# Altium project hethongnhung.PrjPcb
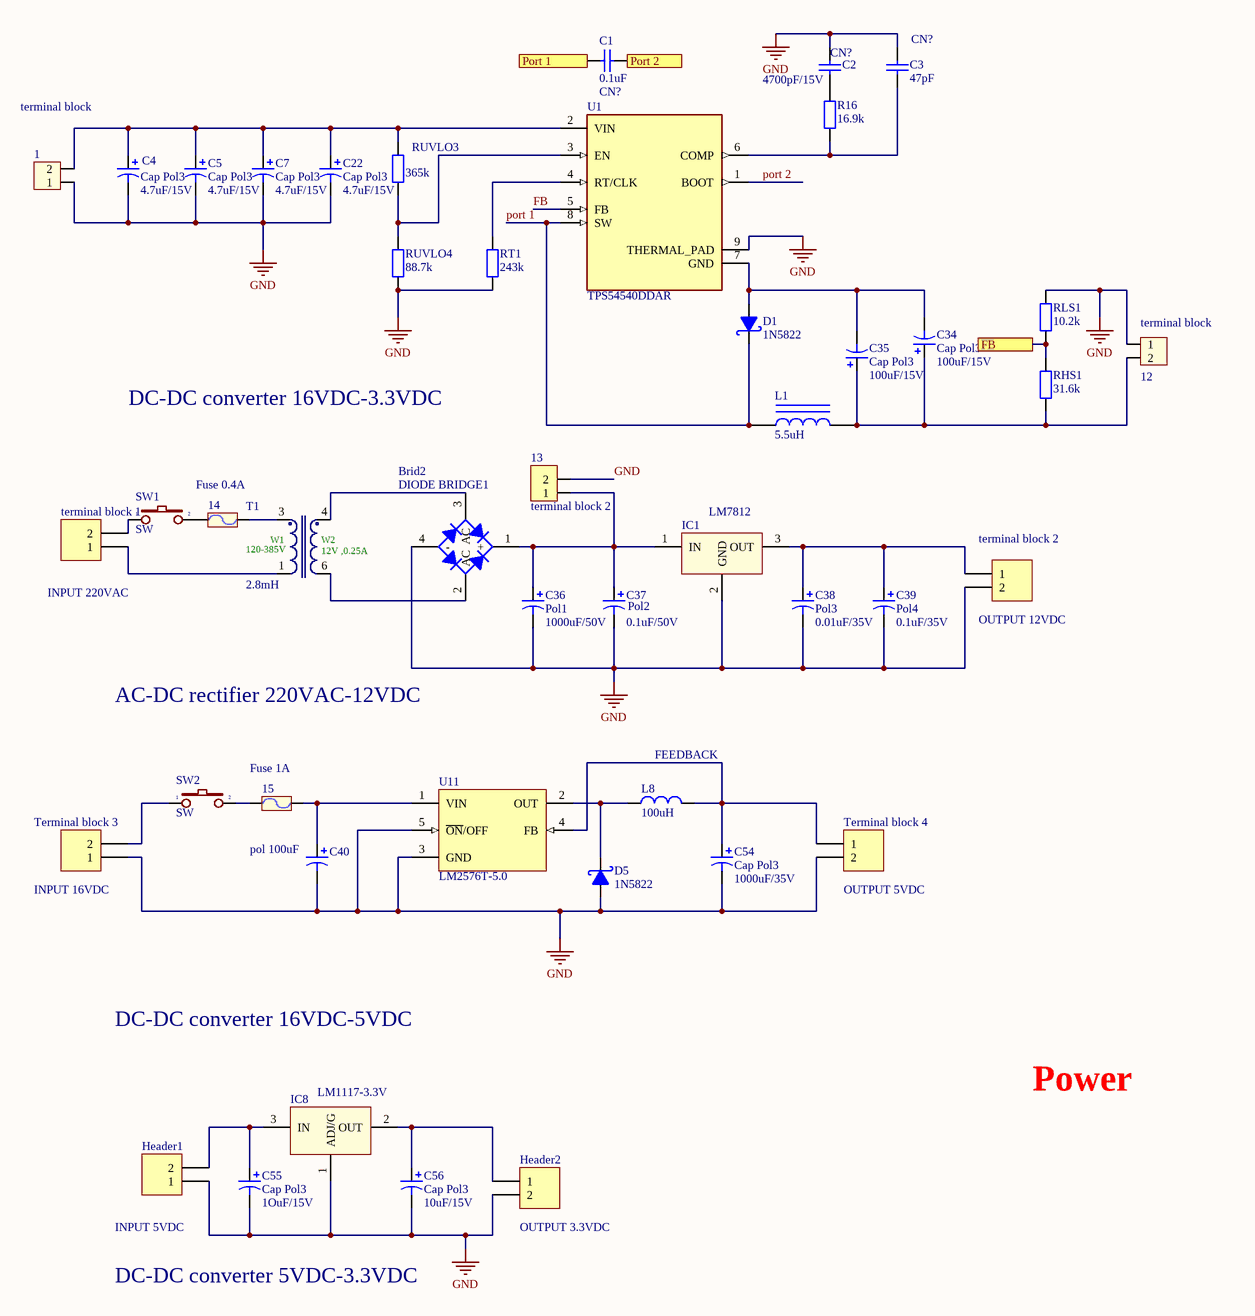
[diagram p0: nguon.SchDoc]
9 sheets, 223 parts. Net scope: flat (ports and power ports of the same name join across sheets).
Sheets:
  nguon.SchDoc
  temperature.SchDoc
  humidity.SchDoc
  lcdi2c.SchDoc
  nhung.SchDoc
  controltemperature.SchDoc
  humiditycontrol.SchDoc
  Alarm.SchDoc
  MCU.SchDoc

## Sheet nguon.SchDoc
size A3

### Parts
(Parts that share a designator on the sheet are numbered #1, #2 ... from top to bottom, then left to right.)
1  terminal block  [HED2]
12  terminal block  [HED2]
13  terminal block 2  [HDR2]
14  Fuse 0.4A  [Fuse]
15  Fuse 1A  [Fuse]
Brid2  DIODE BRIDGE1  [CAU 5A]
C1  0.1uF  value CN?  [CNP]
C2  4700pF/15V  value CN?  [CNP]
C3  47pF  value CN?  [CNP]
C4  Cap Pol3  value 4.7uF/15V  [CP2/5]
C5  Cap Pol3  value 4.7uF/15V  [CP2/5]
C7  Cap Pol3  value 4.7uF/15V  [CP2/5]
C22  Cap Pol3  value 4.7uF/15V  [CP2/5]
C34  Cap Pol3  value 100uF/15V  [CP2/5]
C35  Cap Pol3  value 100uF/15V  [CP2/5]
C36  Pol1  value 1000uF/50V  [CP2/5]
C37  Pol2  value 0.1uF/50V  [CP2/5]
C38  Pol3  value 0.01uF/35V  [CP2/5]
C39  Pol4  value 0.1uF/35V  [CP2/5]
C40  pol 100uF  [C10mm]
C54  Cap Pol3  value 1000uF/35V  [CP2/5]
C55  Cap Pol3  value 1OuF/15V  [CP2/5]
C56  Cap Pol3  value 10uF/15V  [CP2/5]
D1  1N5822  [D5A]
D5  1N5822  [D5A]
Header1  Header 2  [HEDH]  (value not drawn)
Header2  Header 2  [HEDH]  (value not drawn)
IC1  LM7812  [QTO-220]
IC8  LM1117-3.3V  [SOT223-4N]
L1#1  value 5.5uH  [R1/2W]  (hidden comment: Inductor Iron)
L8  100uH  [L/0.4]
R16  16.9k  [R1/4W]
RHS1  31.6k  [R1/4W]
RLS1  10.2k  [R1/4W]
RT1  243k  [R1/4W]
RUVLO3  365k  [R1/4W]
RUVLO4  88.7k  [R1/4W]
SW1  SW  [SW2]
SW2  SW  [SW2]
T1  2.8mH  [EE13/7/4-Vertical/(EF12.6)]
terminal_block_1  Header 2  [HEDH]  (value not drawn)
terminal_block_2  Header 2  [HEDH]  (value not drawn)
Terminal_block_3  Header 2  [HEDH]  (value not drawn)
Terminal_block_4  Header 2  [HEDH]  (value not drawn)
U1  TPS54540DDAR  [CONV_TPS54540DDAR]
U11  LM2576T-5.0  [LM2576t]

### Ports
FB, Port 1, Port 2

### Nets
GND: 1.1 12.1 13.2 Brid2.4(-) C2.2 C3.2 C4.2 C5.2 C7.2 C22.2 C36.2 C37.2 C38.2 C39.2 C40.2 C54.2 C55.2 C56.2 D5.1(A) Header1.1 Header2.2 IC1.2(GND) IC8.1(ADJ/G) RLS1.2 RT1.1 RUVLO4.1 terminal_block_2.2 Terminal_block_3.1 Terminal_block_4.2 U1.9(THERMAL_PAD) U11.3(GND) U11.5(~{ON}/OFF)
FB: U1.5(FB)
port 1: D1.2(K) L1#1.1 U1.8(SW)
port 2: U1.1(BOOT)
Net1_2: 1.2 C4.1 C5.1 C7.1 C22.1 RUVLO3.2 U1.2(VIN)
Net12_2: 12.2 C34.1 C35.1 L1#1.2 RHS1.1
Net13_1: 13.1 Brid2.1(+) C36.1 C37.1 IC1.1(IN)
Net14_1: 14.1 SW1.2
Net14_2: 14.2 T1.3
Net15_1: 15.1 SW2.2
Net15_2: 15.2 C40.1 U11.1(VIN)
NetBrid2_2: Brid2.2(AC) T1.6
NetBrid2_3: Brid2.3(AC) T1.4
NetC1_1: C1.1 ; port Port 2
NetC1_2: C1.2 ; port Port 1
NetC2_1: C2.1 R16.2
NetC3_1: C3.1 R16.1 U1.6(COMP)
NetC34_2: C34.2 C35.2 D1.1(A) U1.7(GND)
NetC38_1: C38.1 C39.1 IC1.3(OUT) terminal_block_2.1
NetC54_1: C54.1 L8.2 Terminal_block_4.1 U11.4(FB)
NetC55_1: C55.1 Header1.2 IC8.3(IN)
NetC56_1: C56.1 Header2.1 IC8.2(OUT)
NetD5_2: D5.2(K) L8.1 U11.2(OUT)
NetRHS_2: RHS1.2 RLS1.1 ; port FB
NetRT1_2: RT1.2 U1.4(RT/CLK)
NetRUVLO3_1: RUVLO3.1 RUVLO4.2 U1.3(EN)
NetSW1_1: SW1.1 terminal_block_1.2
NetSW2_1: SW2.1 Terminal_block_3.2
NetT1_1: T1.1 terminal_block_1.1

### Notes on the sheet
- DC-DC converter 16VDC-3.3VDC
- (near terminal_block_1) INPUT 220VAC
- (near terminal_block_2) OUTPUT 12VDC
- AC-DC rectifier 220VAC-12VDC
- (near L8) FEEDBACK
- (near Terminal_block_3) INPUT 16VDC
- (near Terminal_block_4) OUTPUT 5VDC
- DC-DC converter 16VDC-5VDC
- Power
- (near Header1) INPUT 5VDC
- DC-DC converter 5VDC-3.3VDC
- (near Header2) OUTPUT 3.3VDC
- Title
- Size:
- Date:
- A3
- Number:
- Time:
- Revision:
- Sheet
- of
- File:
- (in symbol Tranf7) W1; W2; 120-385V; 12V ,0.25A

### Library data of the parts
1 12 = Hed2: Header 2 (Green); Value: Header 2
13 = Header2: Header IDC, 2 x 1 Pin Vertical 2.54mm Pitch (Non-Boxed, Male); Manufacturer: W¨¹rth Elektronik eiSos GmbH; partNo: 613002143121; ComponentLink1 Description: Manufacturer; ComponentLink2 Description: Datasheet; NoPins: 02; Created Date: 29 March 2013; ComponentLink1URL: http://www.we-online.com; ComponentLink2URL: http://katalog.we-online.de/em/datasheet/6130xx143121.pdf; Created by: Karrer Zheng
14 15 = Fuse: Designed by: VanDungEvn; Value: Fuse
C1-C3 = Cap Semi: Capacitor (Semiconductor SIM Model); Value: 104; LatestRevisionDate: 17-Jul-2002; LatestRevisionNote: Re-released for DXP Platform.; PackageReference: C1206; Publisher: Altium Limited
C4 C5 C7 C22 C34 C35 C54-C56 = Cap Pol3: Polarized Capacitor (Surface Mount); VALUE: C?; LatestRevisionDate: 17-Jul-2002; LatestRevisionNote: Re-released for DXP Platform.; PackageReference: C0805; Publisher: Altium Limited
C36-C39 = Cap Pol3_5: Polarized Capacitor (Surface Mount); VALUE: C?; LatestRevisionDate: 17-Jul-2002; LatestRevisionNote: Re-released for DXP Platform.; PackageReference: C0805; Publisher: Altium Limited
C40 = Cap Pol 12mm: Polarized Capacitor (Axial); Published: 8-Jun-2000; LatestRevisionDate: 17-Jul-2002; LatestRevisionNote: Re-released for DXP Platform.; PackageReference: POLAR0.8; Publisher: Altium Limited
D1 D5 = 1N5822: Schottky Rectifiers; Value: Diode c?m 1N5408
Header1 Header2 terminal_block_1 terminal_block_2 Terminal_block_3 Terminal_block_4 = Header 2: Header, 2-Pin; Manufacturer: Generic Components; Class: Connector; Value: Header 2
IC1 = LM78xx: On ap +, from + 5 to + 24VDC; Value: LM7805
IC8 = LM1117: Available in 1.8V, 2.5V, 2.85V, 3.3V, 5V, and  Adjustable Versions; Value: LM317
L1#1 = Inductor Iron_1: Magnetic-Core Inductor; Manufacturer: Generic Components; Class: Passive; Published: 1999; SubClass: Inductor
L8 = Inductor: Value: 150 mH
R16 RHS1 RLS1 RT1 RUVLO3 RUVLO4 = R1/4W: Resistor 1/4W; Value: R1/4W - 1K
SW1 SW2 = SW2: Switch button 2 pin; Value: SW chip 2 pin
T1 = Tranf7: Off-Line Transformer WE-UNIT , L=2.8mH; PartNo: 7491181012; Manufacturer: Würth Elektronik eiSos GmbH; Turns Ratio: 8.1:1; Input Voltage (AC): 85-265; Output Current (A): 0.5; Output Voltage (DC): 12; Inductance: 2.8mH; ComponentLink1Description: Manufacturer; ComponentLink1URL: http://www.we-online.de; Created by: Otto Christin; Created Date: OCT 2013; ComponentLink2Description: Datasheet; ComponentLink2URL: http://www.we-online.de/katalog/media/pdf/7491181012.pdf
U1 = TPS54540DDAR: 42 V, 5 A, Step-Down DC-DC Converter with Eco-Mode 8-SO PowerPAD -40 to 125; MF: Texas Instruments; SnapEDA_Link: https://www.snapeda.com/parts/TPS54540DDAR/Texas%20Instruments/view-part/454643/?ref=snap; Package: HSOIC-8 Texas Instruments; Check_prices: https://www.snapeda.com/parts/TPS54540DDAR/Texas%20Instruments/view-part/454643/?ref=eda; MP: TPS54540DDAR; Value: *; Digi-Key_Part_Number: 296-39422-1-ND; Purchase-URL: https://pricing.snapeda.com/search/part/TPS54540DDAR/?ref=eda
U11 = LM2576T-5.0: SIMPLE SWITCHER; 3A Step-Down Voltage Regulator; Manufacturer: National Semiconductor; PackageTopMarking: NSUZXYTT*LM2576T*-5.0 P+; PowerWise: N; FirstPublished: 4-Dec-2008; DatasheetVersion: Aug-2004; PackageVersion: revJ, Jan-1992; PackageReference: T05A; Publisher: Altium Limited; PackageDescription: TO-220, Molded, 5 Lead, Straight; CompType: Switcher; PartNumber: LM2576T-5.0; RoHS: O; PinCount: 5; DigiKeyPartNumber: LM2576T-5.0-ND; Code_JEDEC: TO-220-AB; ComponentLink1Description: LM2576 Datasheet; ComponentLink1URL: http://www.national.com/ds/LM/LM2576.pdf; ComponentLink2Description: LM2576 Web Page; ComponentLink2URL: http://www.national.com/pf/LM/LM2576.html; ComponentLink3Description: T05A Package Page; ComponentLink3URL: http://www.national.com/packaging/folders/t05a.html

## Sheet temperature.SchDoc
size A
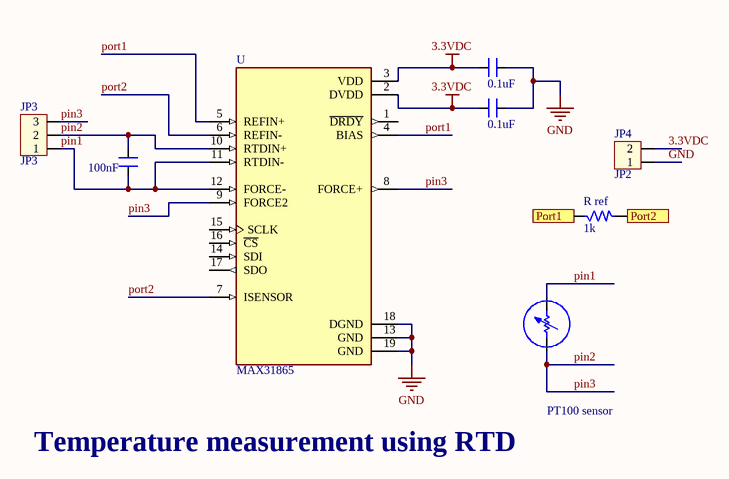
[diagram p1: temperature.SchDoc]

### Parts
(Parts that share a designator on the sheet are numbered #1, #2 ... from top to bottom, then left to right.)
?#1  0.1uF  [SM-0805]
?#2  0.1uF  [SM-0805]
?#3  100nF  [SM-0805]
?#4  (no value)  [AXIAL-0.7]
JP3  JP3  [CON3]
JP4  JP2  [CON2]
R_ref  1k  [SM-RES-1206]
U  MAX31865  [SOP65P777X199-20N]

### Ports
Port1, Port2

### Nets
3.3VDC: ?#1.1 ?#2.1 JP4.2 U.2(DVDD) U.3(VDD)
GND: ?#1.2 ?#2.2 JP4.1 U.13(GND) U.18(DGND) U.19(GND)
pin1: ?#3.1 ?#4.2 JP3.1 U.11(RTDIN-) U.12(FORCE-)
pin2: ?#3.2 ?#4.1 JP3.2 JP3.3 U.8(FORCE+) U.9(FORCE2) U.10(RTDIN+)  [also labelled pin3]
port1: U.4(BIAS) U.5(REFIN+)
port2: U.6(REFIN-) U.7(ISENSOR)
NetR_ref_1: R_ref.1 ; port Port1
NetR_ref_2: R_ref.2 ; port Port2

Not connected (* = marked no-connect by the designer): U 1(~{DRDY}) 14(SDI) 15(SCLK) 16(~{CS}) 17(SDO)

### Notes on the sheet
- PT100 sensor
- Temperature measurement using RTD

### Library data of the parts
?#1-?#3 = CM: Cap SMD; Value: 103
?#4 = Res Adj1: Variable Resistor; Set Position: 0.5; Published: 8-Jun-2000; LatestRevisionDate: 17-Jul-2002; LatestRevisionNote: Re-released for DXP Platform.; PackageReference: AXIAL-0.7; Publisher: Altium Limited; PackageDescription: Axial Device, Thru-Hole; 2 Leads; 0.7 in Pin Spacing
JP3 = Con3: Connector 3; Value: Connector 3
JP4 = Con2: Connector 2; Value: Connector 2
R_ref = R: Resistor 1/4W; Value: R1/4W - 1K
U = MAX31865AAP+: Temp Monitoring System _Sensor_ External Sensor SPI Output 20-SSOP; MF: Maxim Integrated; Price: None; Value: *; MP: MAX31865AAP+; Package: SSOP-20 Maxim; SnapEDA_Link: https://www.snapeda.com/parts/MAX31865AAP%2B/Maxim%20Integrated/view-part/215216/?ref=snap; Availability: Unavailable

## Sheet humidity.SchDoc
size A
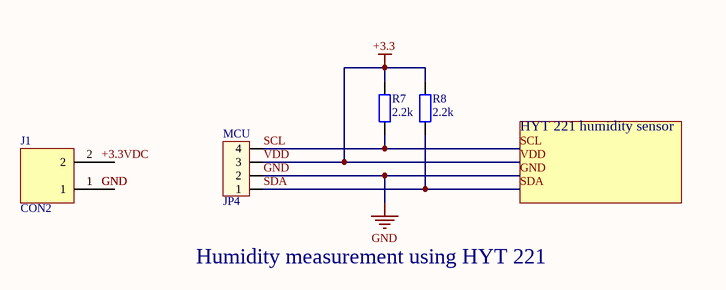
[diagram p2: humidity.SchDoc]

### Parts
J1  CON2  [HEDH]
MCU  JP4  [CON4]
R7  2.2k  [R1/4W]
R8  2.2k  [R1/4W]

### Nets
GND: MCU.2
VDD: MCU.3 R7.2 R8.2  [also labelled +3.3]
SCL: MCU.4 R7.1
SDA: MCU.1 R8.1

Not connected (* = marked no-connect by the designer): J1 1 2

### Notes on the sheet
- HYT 221 humidity sensor
- Humidity measurement using HYT 221
- Labels drawn without touching a wire or pin: +3.3VDC

### Library data of the parts
J1 = CON2_1
MCU = Con4: Connector 4; Value: Connector 4
R7 R8 = R1/4W: Resistor 1/4W; Value: R1/4W - 1K

## Sheet lcdi2c.SchDoc
size A
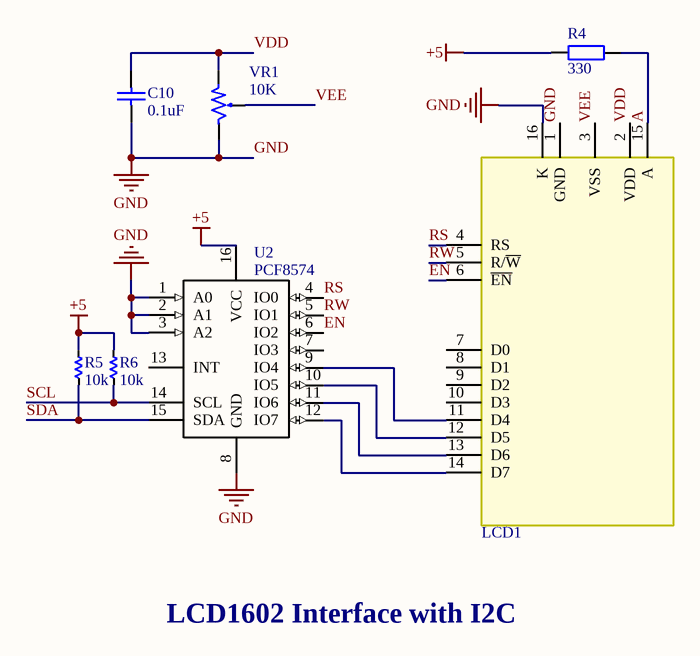
[diagram p3: lcdi2c.SchDoc]

### Parts
C10  0.1uF  [CNP]
LCD1  LCD16x2A  [LCD16X2]  (value not drawn)
R4  330  [R1/4W]
R5  10k  [RES-SMD-0805]
R6  10k  [RES-SMD-0805]
U2  PCF8574  [SO16L]
VR1  10K  [VR]

### Nets
+5: R4.1 R5.1 R6.1 U2.16(VCC)
GND: C10.1 LCD1.1(GND) LCD1.16(K) U2.1(A0) U2.2(A1) U2.3(A2) U2.8(GND) VR1.3
A: LCD1.15(A) R4.2
EN: LCD1.6(~{EN}) U2.6(IO2)
RS: LCD1.4(RS) U2.4(IO0)
RW: LCD1.5(R/~{W}) U2.5(IO1)
SCL: R6.2 U2.14(SCL)
SDA: R5.2 U2.15(SDA)
VDD: C10.2 LCD1.2(VDD) VR1.1
VEE: LCD1.3(VSS) VR1.2
NetLCD1_11: LCD1.11(D4) U2.9(IO4)
NetLCD1_12: LCD1.12(D5) U2.10(IO5)
NetLCD1_13: LCD1.13(D6) U2.11(IO6)
NetLCD1_14: LCD1.14(D7) U2.12(IO7)

Not connected (* = marked no-connect by the designer): LCD1 7(D0) 8(D1) 9(D2) 10(D3); U2 7(IO3) 13(INT)

### Notes on the sheet
- LCD1602 Interface with I2C

### Library data of the parts
C10 = Cap Semi: as C1 on sheet nguon; LatestRevisionDate: 17-Jul-2002; LatestRevisionNote: Re-released for DXP Platform.; PackageReference: C1206; Publisher: Altium Limited
LCD1 = LCD16x2: LCD dipslay 16 char, 2 line; Value: LCD16x2A
R4 = R1/4W: Resistor 1/4W; Value: R1/4W - 1K
R5 R6 = Res-SMD: Resistor; Manufacturer: Generic Components; Class: Passive; Published: 08/06/2000; Publisher: Altium Hobart Technology Centre
U2 = PCF8574: I2C PORT EXPANDER; Manufacturer Part Number: PCF8574T/3,512; Manufacturer: NXP Semiconductors; Includes: POR; Interface: I²C; Interrupt Output: Yes; Number of I /O: 8; Voltage - Supply: 2.5 V ~ 6 V; Frequency - Clock: 100KHz; Supplier 1: Digi-Key; Supplier Part Number 1: 568-1076-5-ND; Package / Case: 16-SOIC (7.5mm Width); Category: Integrated Circuits (ICs); Supplier Part Number: 568-1076-5-ND; Operating Temperature: -40°C ~ 85°C; Packaging: Tube; RoHS: RoHS Compliant; Supplier: Digi-Key
VR1 = VR1: Var Resistor; Value: VR 10K

## Sheet nhung.SchDoc
size 457 x 355 mm
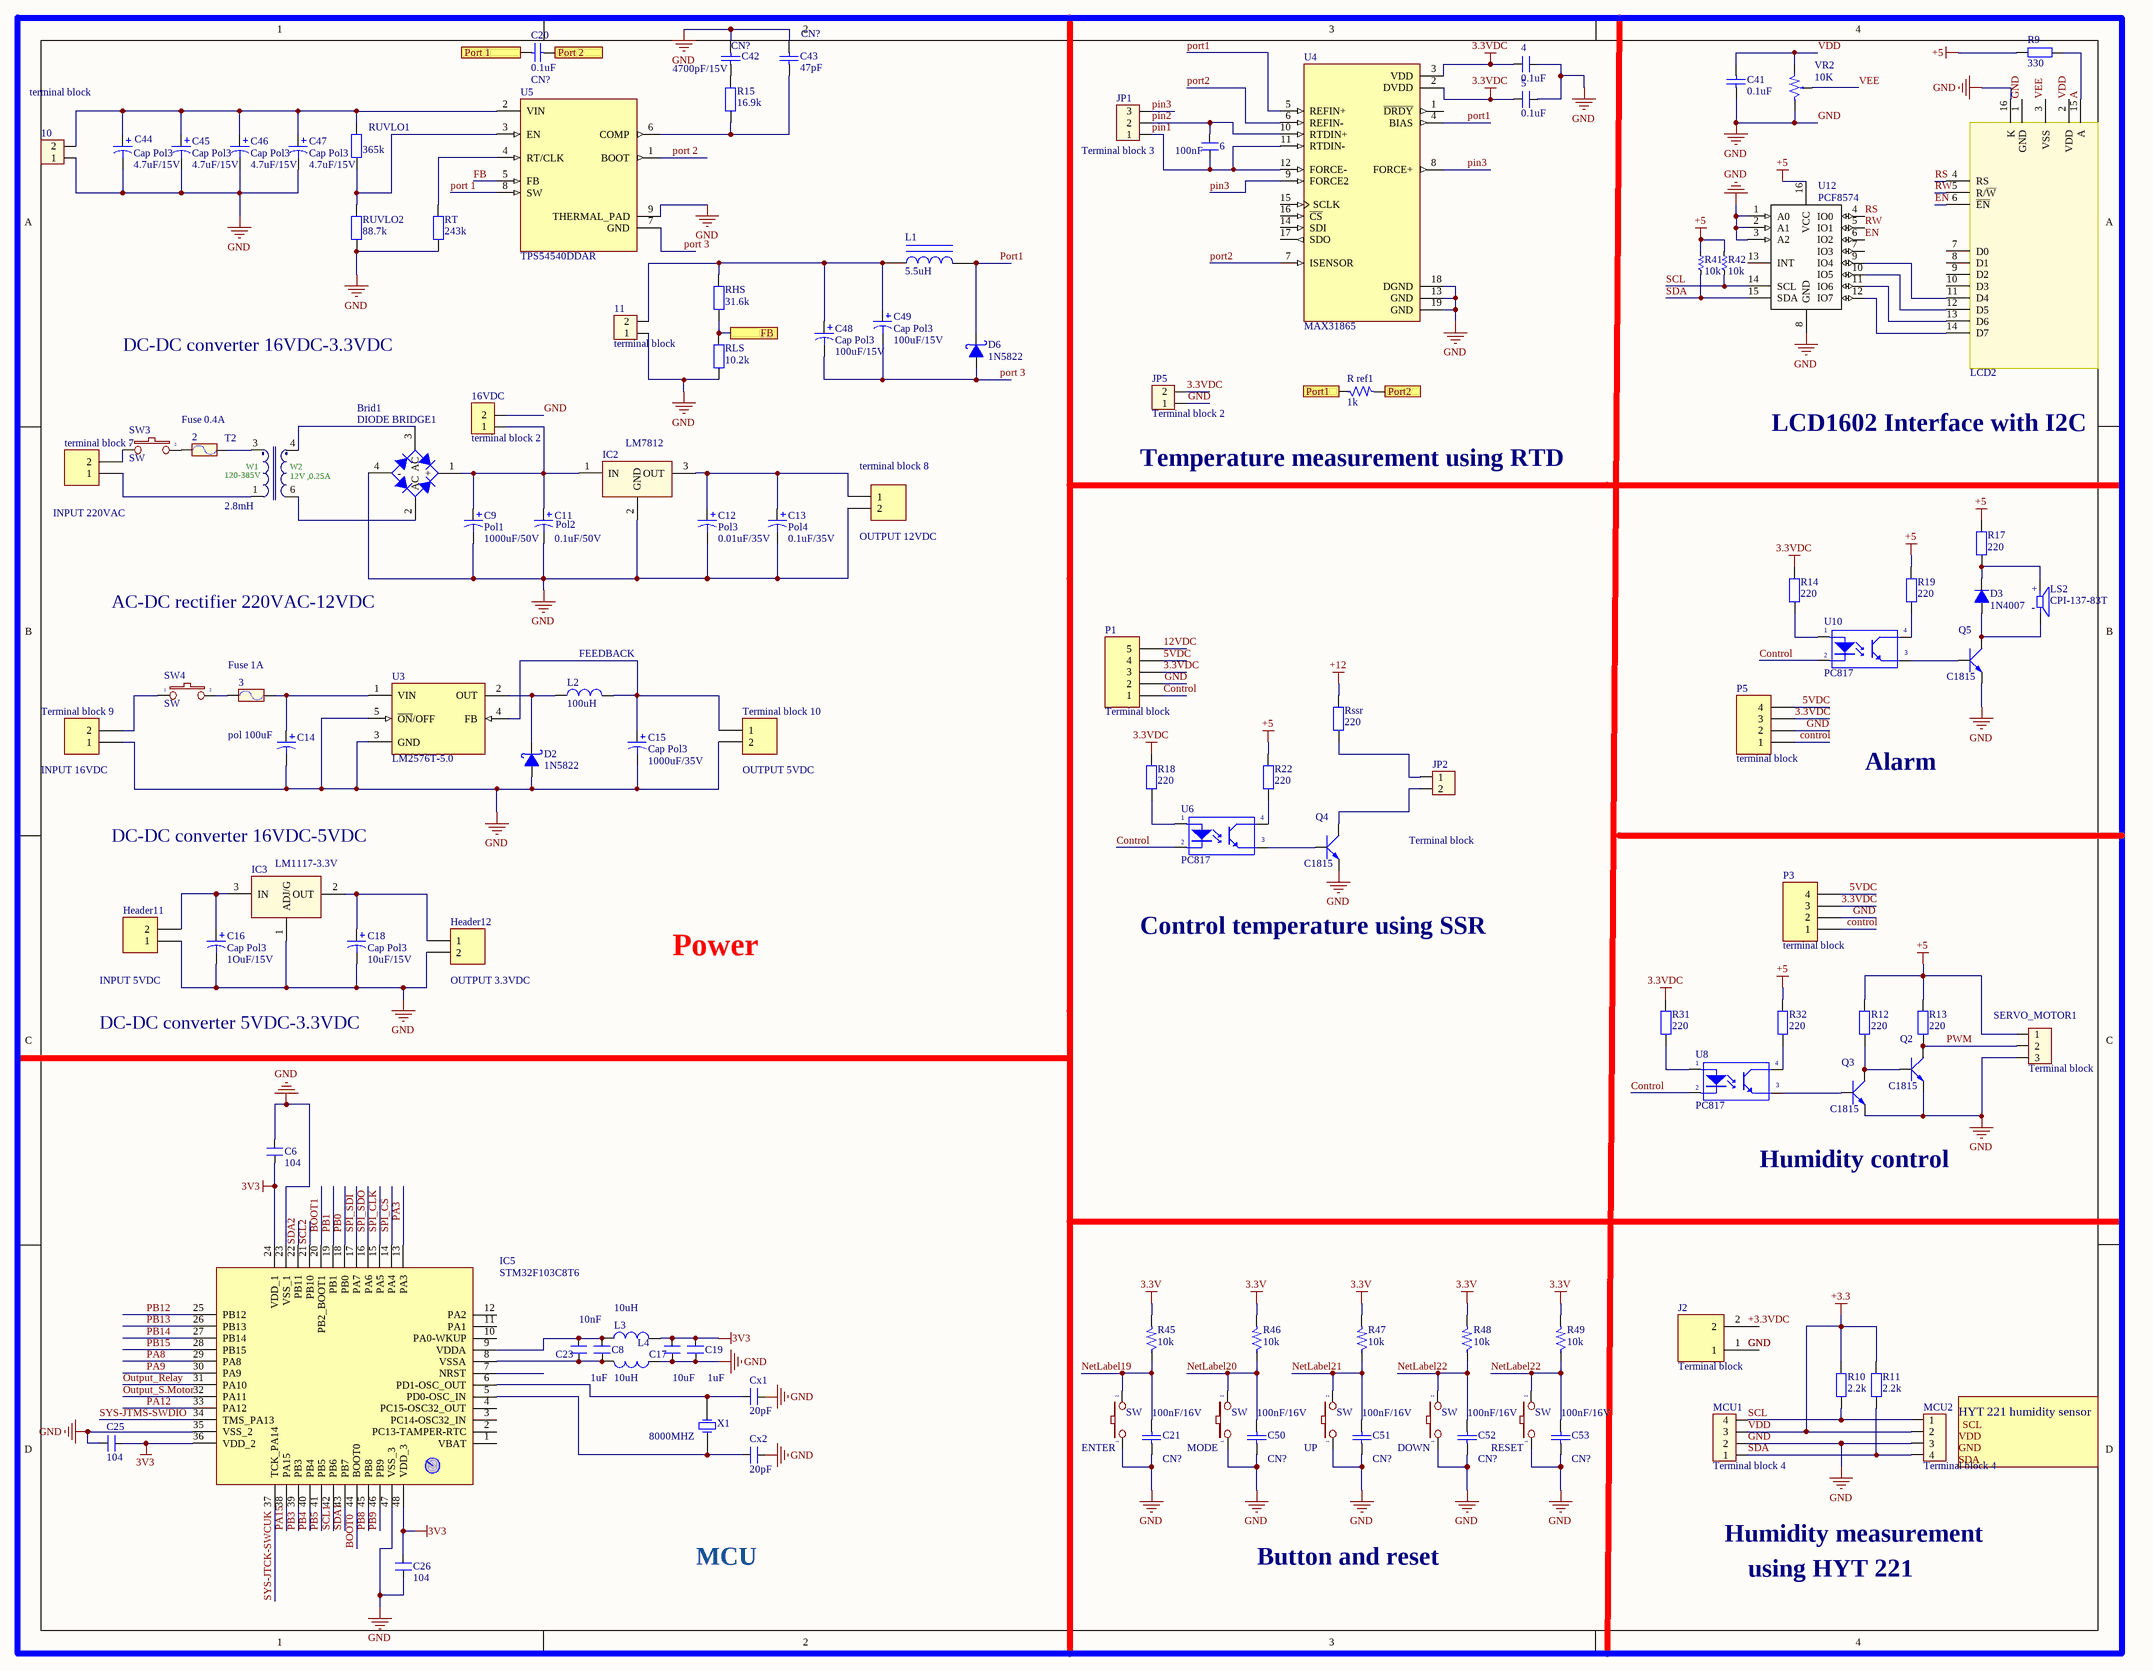
[diagram p4: nhung.SchDoc]

### Parts
(Parts that share a designator on the sheet are numbered #1, #2 ... from top to bottom, then left to right.)
2  Fuse 0.4A  [Fuse]
3  Fuse 1A  [Fuse]
4  0.1uF  [SM-0805]
5  0.1uF  [SM-0805]
6  100nF  [SM-0805]
10  terminal block  [HED2]
11  terminal block  [HED2]
16VDC  terminal block 2  [HDR2]
Brid1  DIODE BRIDGE1  [CAU 5A]
C6  104  [CN2]
C8  1uF  [CN2]
C9  Pol1  value 1000uF/50V  [CP2/5]
C11  Pol2  value 0.1uF/50V  [CP2/5]
C12  Pol3  value 0.01uF/35V  [CP2/5]
C13  Pol4  value 0.1uF/35V  [CP2/5]
C14  pol 100uF  [C10mm]
C15  Cap Pol3  value 1000uF/35V  [CP2/5]
C16  Cap Pol3  value 1OuF/15V  [CP2/5]
C17  10uF  [CN2]
C18  Cap Pol3  value 10uF/15V  [CP2/5]
C19  1uF  [CN2]
C20  0.1uF  value CN?  [CNP]
C21  100nF/16V  value CN?  [CNP]
C23  10nF  [CN2]
C25  104  [CN2]
C26  104  [CN2]
C41  0.1uF  [CNP]
C42  4700pF/15V  value CN?  [CNP]
C43  47pF  value CN?  [CNP]
C44  Cap Pol3  value 4.7uF/15V  [CP2/5]
C45  Cap Pol3  value 4.7uF/15V  [CP2/5]
C46  Cap Pol3  value 4.7uF/15V  [CP2/5]
C47  Cap Pol3  value 4.7uF/15V  [CP2/5]
C48  Cap Pol3  value 100uF/15V  [CP2/5]
C49  Cap Pol3  value 100uF/15V  [CP2/5]
C50  100nF/16V  value CN?  [CNP]
C51  100nF/16V  value CN?  [CNP]
C52  100nF/16V  value CN?  [CNP]
C53  100nF/16V  value CN?  [CNP]
Cx1  20pF  [CN1]
Cx2  20pF  [CN1]
D2  1N5822  [D5A]
D3  1N4007  [D1A]
D6  1N5822  [D5A]
DOWN  SW  [SW2]
ENTER  SW  [SW2]
Header11  Header 2  [HEDH]  (value not drawn)
Header12  Header 2  [HEDH]  (value not drawn)
IC2  LM7812  [QTO-220]
IC3  LM1117-3.3V  [SOT223-4N]
IC5  STM32F103C8T6  [STM32F103C8T6]
J2  Terminal block  [HEDH]
JP1  Terminal block 3  [CON3]
JP2  Terminal block  [CON2]
JP5  Terminal block 2  [CON2]
L1#2  value 5.5uH  [R1/2W]  (hidden comment: Inductor Iron)
L2  100uH  [L/0.4]
L3  10uH  [L/0.4]
L4  10uH  [L/0.4]
LCD2  LCD16x2A  [LCD16X2]  (value not drawn)
LS2  CPI-137-83T  [XDCR_CPI-137-83T]
MCU1  Terminal block 4  [CON4]
MCU2  Terminal block 4  [CON4]
MODE  SW  [SW2]
P1  Terminal block  [HDR1X5]
P3  terminal block  [HDR1X4]
P5  terminal block  [HDR1X4]
Q2  C1815  [QTO-92]
Q3  C1815  [QTO-92]
Q4  C1815  [QTO-92]
Q5  C1815  [QTO-92]
R9  330  [R1/4W]
R10  2.2k  [R1/4W]
R11  2.2k  [R1/4W]
R12  220  [R1/4W]
R13  220  [R1/4W]
R14  220  [R1/4W]
R15  16.9k  [R1/4W]
R17  220  [R1/4W]
R18  220  [R1/4W]
R19  220  [R1/4W]
R22  220  [R1/4W]
R31  220  [R1/4W]
R32  220  [R1/4W]
R41  10k  [RES-SMD-0805]
R42  10k  [RES-SMD-0805]
R45  10k  [SM-RES-1206]
R46  10k  [SM-RES-1206]
R47  10k  [SM-RES-1206]
R48  10k  [SM-RES-1206]
R49  10k  [SM-RES-1206]
R_ref1  1k  [SM-RES-1206]
RESET  SW  [SW2]
RHS  31.6k  [R1/4W]
RLS  10.2k  [R1/4W]
Rssr  220  [R1/4W]
RT  243k  [R1/4W]
RUVLO1  365k  [R1/4W]
RUVLO2  88.7k  [R1/4W]
SERVO_MOTOR1  Terminal block  [CON3]
SW3  SW  [SW2]
SW4  SW  [SW2]
T2  2.8mH  [EE13/7/4-Vertical/(EF12.6)]
terminal_block_7  Header 2  [HEDH]  (value not drawn)
terminal_block_8  Header 2  [HEDH]  (value not drawn)
Terminal_block_9  Header 2  [HEDH]  (value not drawn)
Terminal_block_10  Header 2  [HEDH]  (value not drawn)
U3  LM2576T-5.0  [LM2576t]
U4  MAX31865  [SOP65P777X199-20N]
U5  TPS54540DDAR  [CONV_TPS54540DDAR]
U6  PC817  [DIP4/W0.3]
U8  PC817  [DIP4/W0.3]
U10  PC817  [DIP4/W0.3]
U12  PCF8574  [SO16L]
UP  SW  [SW2]
VR2  10K  [VR]
X1  8000MHZ  [XTAL]

### Ports
FB, Port1, Port2, Port 1, Port 2

### Nets
3.3V: R45.2 R46.2 R47.2 R48.2 R49.2
3.3VDC: 4.1 5.1 JP5.2 P1.3 P3.3 P5.3 R14.2 R18.2 R31.2 U4.2(DVDD) U4.3(VDD)
3V3: C6.1 C17.1 C19.1 C25.2 C26.2 IC5.24(VDD_1) IC5.36(VDD_2) IC5.48(VDD_3) L3.2
+5: R9.1 R12.2 R13.2 R17.2 R19.2 R22.2 R32.2 R41.1 R42.1 SERVO_MOTOR1.1 U12.16(VCC)
+12: Rssr.2
GND: 4.2 5.2 10.1 11.1 16VDC.2 Brid1.4(-) C6.2 C9.2 C11.2 C12.2 C13.2 C14.2 C15.2 C16.2 C17.2 C18.2 C19.2 C21.1 C25.1 C26.1 C41.1 C42.2 C43.2 C44.2 C45.2 C46.2 C47.2 C50.1 C51.1 C52.1 C53.1 Cx1.1 Cx2.1 D2.1(A) DOWN.1 ENTER.1 Header11.1 Header12.2 IC2.2(GND) IC3.1(ADJ/G) IC5.23(VSS_1) IC5.35(VSS_2) IC5.47(VSS_3) JP5.1 L4.1 LCD2.1(GND) LCD2.16(K) MCU1.2 MCU2.3 MODE.1 P1.2 P3.2 P5.2 Q2.1(E) Q3.1(E) Q4.1(E) Q5.1(E) RESET.1 RLS.2 RT.1 RUVLO2.1 SERVO_MOTOR1.3 terminal_block_8.2 Terminal_block_9.1 Terminal_block_10.2 U3.3(GND) U3.5(~{ON}/OFF) U4.13(GND) U4.18(DGND) U4.19(GND) U5.9(THERMAL_PAD) U12.1(A0) U12.2(A1) U12.3(A2) U12.8(GND) UP.1 VR2.3
VDD: C41.2 LCD2.2(VDD) MCU1.3 MCU2.2 R10.2 R11.2 VR2.1  [also labelled +3.3]
5VDC: P1.4 P3.4 P5.4
12VDC: P1.5
A: LCD2.15(A) R9.2
BOOT0: IC5.44(BOOT0)
BOOT1: IC5.20(PB2_BOOT1)
Control: P1.1 P3.1 P5.1 U6.2(K) U8.2(K) U10.2(K)
EN: LCD2.6(~{EN}) U12.6(IO2)
FB: U5.5(FB)
NetLabel19: C21.2 ENTER.2 R45.1
NetLabel20: C50.2 MODE.2 R46.1
NetLabel21: C51.2 R47.1 UP.2
NetLabel22: C52.2 C53.2 DOWN.2 R48.1 R49.1 RESET.2
Output_Relay: IC5.31(PA10)
Output_S.Motor: IC5.32(PA11)
PA3: IC5.13(PA3)
PA8: IC5.29(PA8)
PA9: IC5.30(PA9)
PA12: IC5.33(PA12)
PA15: IC5.38(PA15)
PB0: IC5.18(PB0)
PB1: IC5.19(PB1)
PB3: IC5.39(PB3)
PB4: IC5.40(PB4)
PB5: IC5.41(PB5)
PB8: IC5.45(PB8)
PB9: IC5.46(PB9)
PB12: IC5.25(PB12)
PB13: IC5.26(PB13)
PB14: IC5.27(PB14)
PB15: IC5.28(PB15)
pin1: 6.1 JP1.1 U4.11(RTDIN-) U4.12(FORCE-)
pin2: 6.2 JP1.2 U4.10(RTDIN+)
pin3: JP1.3 U4.8(FORCE+) U4.9(FORCE2)
port1: D6.2(K) L1#2.2 U4.4(BIAS) U4.5(REFIN+)
port2: U4.6(REFIN-) U4.7(ISENSOR)
port 1: U5.8(SW)
port 2: U5.1(BOOT)
port 3: C48.2 C49.2 D6.1(A) U5.7(GND)
PWM: Q2.2(C) R13.1 SERVO_MOTOR1.2
RS: LCD2.4(RS) U12.4(IO0)
RW: LCD2.5(R/~{W}) U12.5(IO1)
SCL: MCU1.4 MCU2.1 R10.1 R42.2 U12.14(SCL)
SCL1: IC5.42(PB6)
SCL2: IC5.21(PB10)
SDA: MCU1.1 MCU2.4 R11.1 R41.2 U12.15(SDA)
SDA1: IC5.43(PB7)
SDA2: IC5.22(PB11)
SPI_CLK: IC5.15(PA5)
SPI_CS: IC5.14(PA4)
SPI_SDI: IC5.17(PA7)
SPI_SDO: IC5.16(PA6)
SYS-JTCK-SWCUK: IC5.37(TCK_PA14)
SYS-JTMS-SWDIO: IC5.34(TMS_PA13)
VEE: LCD2.3(VSS) VR2.2
Net2_1: 2.1 SW3.2
Net2_2: 2.2 T2.3
Net3_1: 3.1 SW4.2
Net3_2: 3.2 C14.1 U3.1(VIN)
Net10_2: 10.2 C44.1 C45.1 C46.1 C47.1 RUVLO1.2 U5.2(VIN)
Net11_2: 11.2 C48.1 C49.1 L1#2.1 RHS.1
Net16VDC_1: 16VDC.1 Brid1.1(+) C9.1 C11.1 IC2.1(IN)
NetBrid1_2: Brid1.2(AC) T2.6
NetBrid1_3: Brid1.3(AC) T2.4
NetC1_1: C20.1 ; port Port 2
NetC1_2: C20.2 ; port Port 1
NetC8_1: C8.1 C23.1 IC5.9(VDDA) L3.1
NetC8_2: C8.2 C23.2 IC5.8(VSSA) L4.2
NetC12_1: C12.1 C13.1 IC2.3(OUT) terminal_block_8.1
NetC15_1: C15.1 L2.2 Terminal_block_10.1 U3.4(FB)
NetC16_1: C16.1 Header11.2 IC3.3(IN)
NetC18_1: C18.1 Header12.1 IC3.2(OUT)
NetC42_1: C42.1 R15.2
NetC43_1: C43.1 R15.1 U5.6(COMP)
NetCx1_2: Cx1.2 IC5.6(PD1-OSC_OUT) X1.2(OSC2)
NetCx2_2: Cx2.2 IC5.5(PD0-OSC_IN) X1.1(OSC1)
NetD2_2: D2.2(K) L2.1 U3.2(OUT)
NetD3_1: D3.1(A) LS2.N Q5.2(C)
NetD3_2: D3.2(K) LS2.P R17.1
NetJP2_1: JP2.1 Rssr.1
NetJP2_2: JP2.2 Q4.2(C)
NetLCD2_11: LCD2.11(D4) U12.9(IO4)
NetLCD2_12: LCD2.12(D5) U12.10(IO5)
NetLCD2_13: LCD2.13(D6) U12.11(IO6)
NetLCD2_14: LCD2.14(D7) U12.12(IO7)
NetQ2_3: Q2.3(B) Q3.2(C) R12.1
NetQ3_3: Q3.3(B) U8.3(E)
NetQ4_3: Q4.3(B) U6.3(E)
NetQ5_3: Q5.3(B) U10.3(E)
NetR14_1: R14.1 U10.1(A)
NetR18_1: R18.1 U6.1(A)
NetR19_1: R19.1 U10.4(C)
NetR22_1: R22.1 U6.4(C)
NetR31_1: R31.1 U8.1(A)
NetR32_1: R32.1 U8.4(C)
NetR_ref_1: R_ref1.1 ; port Port1
NetR_ref_2: R_ref1.2 ; port Port2
NetRHS_2: RHS.2 RLS.1 ; port FB
NetRT_2: RT.2 U5.4(RT/CLK)
NetRUVLO1_1: RUVLO1.1 RUVLO2.2 U5.3(EN)
NetSW3_1: SW3.1 terminal_block_7.2
NetSW4_1: SW4.1 Terminal_block_9.2
NetT2_1: T2.1 terminal_block_7.1

Not connected (* = marked no-connect by the designer): IC5 1(VBAT) 2(PC13-TAMPER-RTC) 3(PC14-OSC32_IN) 4(PC15-OSC32_OUT) 7(NRST) 10(PA0-WKUP) 11(PA1) 12(PA2); J2 1 2; LCD2 7(D0) 8(D1) 9(D2) 10(D3); U4 1(~{DRDY}) 14(SDI) 15(SCLK) 16(~{CS}) 17(SDO); U12 7(IO3) 13(INT)

### Notes on the sheet
- DC-DC converter 16VDC-3.3VDC
- LCD1602 Interface with I2C
- Temperature measurement using RTD
- (near terminal_block_7) INPUT 220VAC
- (near terminal_block_8) OUTPUT 12VDC
- AC-DC rectifier 220VAC-12VDC
- (near L2) FEEDBACK
- (near Terminal_block_9) INPUT 16VDC
- (near Terminal_block_10) OUTPUT 5VDC
- Alarm
- DC-DC converter 16VDC-5VDC
- Power
- Control temperature using SSR
- (near Header11) INPUT 5VDC
- DC-DC converter 5VDC-3.3VDC
- (near Header12) OUTPUT 3.3VDC
- Humidity control
- (near MCU2) HYT 221 humidity sensor
- Humidity measurement
- MCU
- Button and reset
- using HYT 221
- Labels drawn without touching a wire or pin: +3.3VDC, GND, SCL, SDA, VDD
- Title
- Size:
- Date:
- A3
- Number:
- Time:
- Revision:
- Sheet
- of
- File:
- (in symbol CPI-137-83T) +; -
- (in symbol Tranf7) W1; W2; 120-385V; 12V ,0.25A

### Library data of the parts
2 3 = Fuse: Designed by: VanDungEvn; Value: Fuse
4-6 = CM: Cap SMD; Value: 103
10 11 = Hed2: Header 2 (Green); Value: Header 2
16VDC = Header2: as 13 on sheet nguon; Created Date: 29 March 2013; ComponentLink1URL: http://www.we-online.com; ComponentLink2URL: http://katalog.we-online.de/em/datasheet/6130xx143121.pdf; Created by: Karrer Zheng
C6 C8 C17 C19 C23 C25 C26 = CN2: Cap np 104 => 105pF; Value: 0.1uF
C9 C11-C13 = Cap Pol3_5: as C36 on sheet nguon; LatestRevisionDate: 17-Jul-2002; LatestRevisionNote: Re-released for DXP Platform.; PackageReference: C0805; Publisher: Altium Limited
C14 = Cap Pol 12mm: Polarized Capacitor (Axial); Published: 8-Jun-2000; LatestRevisionDate: 17-Jul-2002; LatestRevisionNote: Re-released for DXP Platform.; PackageReference: POLAR0.8; Publisher: Altium Limited
C15 C16 C18 C44-C49 = Cap Pol3: as C4 on sheet nguon; LatestRevisionDate: 17-Jul-2002; LatestRevisionNote: Re-released for DXP Platform.; PackageReference: C0805; Publisher: Altium Limited
C20 C21 C41-C43 C50-C53 = Cap Semi: as C1 on sheet nguon; LatestRevisionDate: 17-Jul-2002; LatestRevisionNote: Re-released for DXP Platform.; PackageReference: C1206; Publisher: Altium Limited
Cx1 Cx2 = CN0: Cremic For Xtal 1pF => 100pF; Value: 33pF
D2 D6 = 1N5822: as D1 on sheet nguon
D3 = D1A: Diode 1A; Value: 1N4007
DOWN ENTER MODE RESET SW3 SW4 UP = SW2: as SW1 on sheet nguon
Header11 Header12 terminal_block_7 terminal_block_8 Terminal_block_9 Terminal_block_10 = Header 2: as Header1 on sheet nguon; Value: Header 2
IC2 = LM78xx: as IC1 on sheet nguon
IC3 = LM1117: as IC8 on sheet nguon
J2 = CON2_1
JP1 SERVO_MOTOR1 = Con3: Connector 3; Value: Connector 3
JP2 JP5 = Con2: Connector 2; Value: Connector 2
L1#2 = Inductor Iron_1: as L1#1 on sheet nguon; Published: 1999; SubClass: Inductor
L2 = Inductor: Value: 150 mH
L3 L4 = L1: Inductor; Value: 150 mH
LCD2 = LCD16x2: LCD dipslay 16 char, 2 line; Value: LCD16x2A
LS2 = CPI-137-83T: 13.9 mm, 5 Vdc, 83 dB, Through Hole, Driving Circuit, Piezo Audio Indicator Buzzer; MF: CUI Devices; Digi-Key_Part_Number: 2223-CPI-137-83T-ND; SnapEDA_Link: https://www.snapeda.com/parts/CPI-137-83T/CUI%20Devices/view-part/4502141/?ref=snap; Value: *; Digi-Key_Purchase_URL: https://www.digikey.com/product-detail/en/cui-devices/CPI-137-83T/2223-CPI-137-83T-ND/11480414?utm_source=snapeda&utm_medium=aggregator&utm_campaign=symbol; Package: CUI Devices; MP: CPI-137-83T; CUI_purchase_URL: https://www.cuidevices.com/product/audio/buzzers/audio-indicators/cpi-137-83t?utm_source=snapeda.com&utm_medium=referral&utm_campaign=snapedaBOM
MCU1 MCU2 = Con4: Connector 4; Value: Connector 4
P1 = Header 5: Header, 5-Pin; LatestRevisionDate: 17-Jul-2002; LatestRevisionNote: Re-released for DXP Platform.; Publisher: Altium Limited
P3 P5 = Header 4: Header, 4-Pin; LatestRevisionDate: 17-Jul-2002; LatestRevisionNote: Re-released for DXP Platform.; Publisher: Altium Limited
Q2-Q5 = C1815: NPN 600mW, ECB; Value: C1815
R9-R15 R17-R19 R22 R31 R32 RHS RLS Rssr RT RUVLO1 RUVLO2 = R1/4W: Resistor 1/4W; Value: R1/4W - 1K
R41 R42 = Res-SMD: as R5 on sheet lcdi2c; Published: 08/06/2000; Publisher: Altium Hobart Technology Centre
R45-R49 R_ref1 = R: Resistor 1/4W; Value: R1/4W - 1K
T2 = Tranf7: as T1 on sheet nguon; Inductance: 2.8mH; ComponentLink1Description: Manufacturer; ComponentLink1URL: http://www.we-online.de; Created by: Otto Christin; Created Date: OCT 2013; ComponentLink2Description: Datasheet; ComponentLink2URL: http://www.we-online.de/katalog/media/pdf/7491181012.pdf
U3 = LM2576T-5.0: as U11 on sheet nguon; FirstPublished: 4-Dec-2008; DatasheetVersion: Aug-2004; PackageVersion: revJ, Jan-1992; PackageReference: T05A; Publisher: Altium Limited; PackageDescription: TO-220, Molded, 5 Lead, Straight; CompType: Switcher; PartNumber: LM2576T-5.0; RoHS: O; PinCount: 5; DigiKeyPartNumber: LM2576T-5.0-ND; Code_JEDEC: TO-220-AB; ComponentLink1Description: LM2576 Datasheet; ComponentLink1URL: http://www.national.com/ds/LM/LM2576.pdf; ComponentLink2Description: LM2576 Web Page; ComponentLink2URL: http://www.national.com/pf/LM/LM2576.html; ComponentLink3Description: T05A Package Page; ComponentLink3URL: http://www.national.com/packaging/folders/t05a.html
U4 = MAX31865AAP+: as U on sheet temperature; Price: None; Value: *; MP: MAX31865AAP+; Package: SSOP-20 Maxim; SnapEDA_Link: https://www.snapeda.com/parts/MAX31865AAP%2B/Maxim%20Integrated/view-part/215216/?ref=snap; Availability: Unavailable
U5 = TPS54540DDAR: as U1 on sheet nguon; SnapEDA_Link: https://www.snapeda.com/parts/TPS54540DDAR/Texas%20Instruments/view-part/454643/?ref=snap; Package: HSOIC-8 Texas Instruments; Check_prices: https://www.snapeda.com/parts/TPS54540DDAR/Texas%20Instruments/view-part/454643/?ref=eda; MP: TPS54540DDAR; Value: *; Digi-Key_Part_Number: 296-39422-1-ND; Purchase-URL: https://pricing.snapeda.com/search/part/TPS54540DDAR/?ref=eda
U6 U8 U10 = PC817: Single Opto; Value: PC817
U12 = PCF8574: as U2 on sheet lcdi2c; Supplier 1: Digi-Key; Supplier Part Number 1: 568-1076-5-ND; Package / Case: 16-SOIC (7.5mm Width); Category: Integrated Circuits (ICs); Supplier Part Number: 568-1076-5-ND; Operating Temperature: -40°C ~ 85°C; Packaging: Tube; RoHS: RoHS Compliant; Supplier: Digi-Key
VR2 = VR1: Var Resistor; Value: VR 10K
X1 = XTAL: Crystal Oscillator; Published: 8-Jun-2000; LatestRevisionDate: 17-Jul-2002; LatestRevisionNote: Re-released for DXP Platform.; PackageReference: R38; Publisher: Altium Limited

## Sheet controltemperature.SchDoc
size A
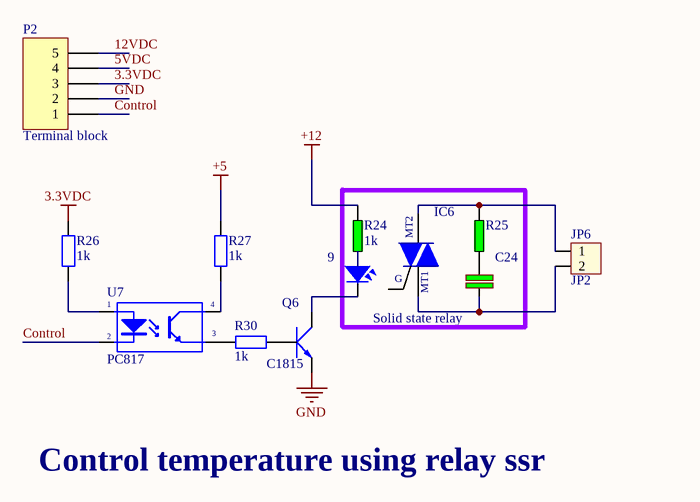
[diagram p5: controltemperature.SchDoc]

### Parts
9  Solid state relay  [LED-3]
C24  (no value)  [CN1]
IC6  (no value)  [QTO-220]
JP6  JP2  [CON2]
P2  Terminal block  [HDR1X5]
Q6  C1815  [QTO-92]
R24  1k  [SM-1206]
R25  (no value)  [SM-1206]
R26  1k  [R1/4W]
R27  1k  [R1/4W]
R30  1k  [R1/4W]
U7  PC817  [DIP4/W0.3]

### Nets
3.3VDC: P2.3 R26.2
+5: R27.2
+12: R24.2
GND: P2.2 Q6.1(E)
5VDC: P2.4
12VDC: P2.5
Control: P2.1 U7.2(K)
Net9_1: 9.1 R24.1
Net9_2: 9.2 Q6.2(C)
NetC24_1: C24.1 IC6.1(MT1) JP6.2
NetC24_2: C24.2 R25.1
NetIC6_2: IC6.2(MT2) JP6.1 R25.2
NetQ6_3: Q6.3(B) R30.2
NetR26_1: R26.1 U7.1(A)
NetR27_1: R27.1 U7.4(C)
NetR30_1: R30.1 U7.3(E)

Not connected (* = marked no-connect by the designer): IC6 3(IN)

### Notes on the sheet
- Control temperature using relay ssr
- (in symbol BT137) G

### Library data of the parts
9 = LED: LED Single colour Green and Red; Value: LED 3 ly Single Colour
C24 = CAP: Cap np  1pF - 472pF; Value: 100pF
IC6 = BT137: Triacs - 8A; Value: LM317
JP6 = Con2: Connector 2; Value: Connector 2
P2 = Header 5: Header, 5-Pin; LatestRevisionDate: 17-Jul-2002; LatestRevisionNote: Re-released for DXP Platform.; Publisher: Altium Limited
Q6 = C1815: NPN 600mW, ECB; Value: C1815
R24 R25 = RES: Resistor 1/4W; Value: R1/4W - 1K
R26 R27 R30 = R1/4W: Resistor 1/4W; Value: R1/4W - 1K
U7 = PC817: Single Opto; Value: PC817

## Sheet humiditycontrol.SchDoc
size A
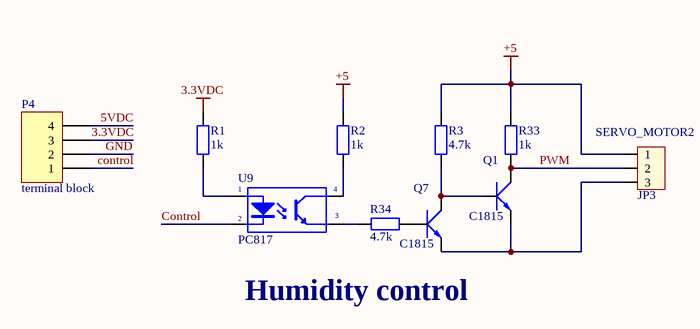
[diagram p6: humiditycontrol.SchDoc]

### Parts
P4  terminal block  [HDR1X4]
Q1  C1815  [QTO-92]
Q7  C1815  [QTO-92]
R1  1k  [R1/4W]
R2  1k  [R1/4W]
R3  4.7k  [R1/4W]
R33  1k  [R1/4W]
R34  4.7k  [R1/4W]
SERVO_MOTOR2  JP3  [CON3]
U9  PC817  [DIP4/W0.3]

### Nets
3.3VDC: P4.3 R1.2
+5: R2.2 R3.2 R33.2 SERVO_MOTOR2.1
5VDC: P4.4
Control: P4.1 U9.2(K)
GND: P4.2
PWM: Q1.2(C) R33.1 SERVO_MOTOR2.2
NetQ1_1: Q1.1(E) Q7.1(E) SERVO_MOTOR2.3
NetQ1_3: Q1.3(B) Q7.2(C) R3.1
NetQ7_3: Q7.3(B) R34.1
NetR1_1: R1.1 U9.1(A)
NetR2_1: R2.1 U9.4(C)
NetR34_2: R34.2 U9.3(E)

### Notes on the sheet
- Humidity control

### Library data of the parts
P4 = Header 4: Header, 4-Pin; LatestRevisionDate: 17-Jul-2002; LatestRevisionNote: Re-released for DXP Platform.; Publisher: Altium Limited
Q1 Q7 = C1815: NPN 600mW, ECB; Value: C1815
R1-R3 R33 R34 = R1/4W: Resistor 1/4W; Value: R1/4W - 1K
SERVO_MOTOR2 = Con3: Connector 3; Value: Connector 3
U9 = PC817: Single Opto; Value: PC817

## Sheet Alarm.SchDoc
size A
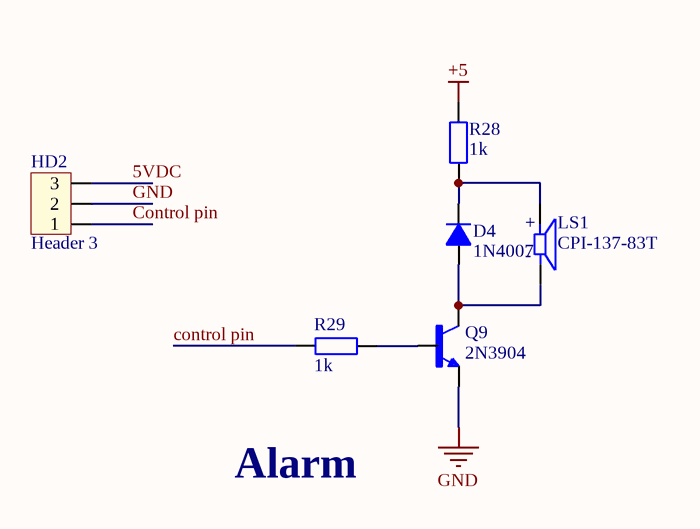
[diagram p7: Alarm.SchDoc]

### Parts
D4  1N4007  [D1A]
HD2  Header 3  [HED3]
LS1  CPI-137-83T  [XDCR_CPI-137-83T]
Q9  2N3904  [TO92127P495H495-3]
R28  1k  [R1/4W]
R29  1k  [R1/4W]

### Nets
+5: R28.2
GND: HD2.2 Q9.1(E)
5VDC: HD2.3
control pin: HD2.1 R29.1
NetD4_1: D4.1(A) LS1.N Q9.3(C)
NetD4_2: D4.2(K) LS1.P R28.1
NetQ9_2: Q9.2(B) R29.2

### Notes on the sheet
- Alarm
- (in symbol CPI-137-83T) +; -

### Library data of the parts
D4 = D1A: Diode 1A; Value: 1N4007
HD2 = Hed3: Header 3 (Green); Value: Header 3
LS1 = CPI-137-83T: as LS2 on sheet nhung; Digi-Key_Part_Number: 2223-CPI-137-83T-ND; SnapEDA_Link: https://www.snapeda.com/parts/CPI-137-83T/CUI%20Devices/view-part/4502141/?ref=snap; Value: *; Digi-Key_Purchase_URL: https://www.digikey.com/product-detail/en/cui-devices/CPI-137-83T/2223-CPI-137-83T-ND/11480414?utm_source=snapeda&utm_medium=aggregator&utm_campaign=symbol; Package: CUI Devices; MP: CPI-137-83T; CUI_purchase_URL: https://www.cuidevices.com/product/audio/buzzers/audio-indicators/cpi-137-83t?utm_source=snapeda.com&utm_medium=referral&utm_campaign=snapedaBOM
Q9 = 2N3904: Bipolar _BJT_ Transistor NPN 40V 200mA 270MHz 625mW Through Hole TO-92-3; MF: MICROSS/On Semiconductor; Package: TO-92 Continental Device; Availability: Unavailable; MP: 2N3904; Value: *; SnapEDA_Link: https://www.snapeda.com/parts/2N3904/MICROSS/On%20Semiconductor/view-part/799649/?ref=snap; Price: None
R28 R29 = R1/4W: Resistor 1/4W; Value: R1/4W - 1K

## Sheet MCU.SchDoc
size A
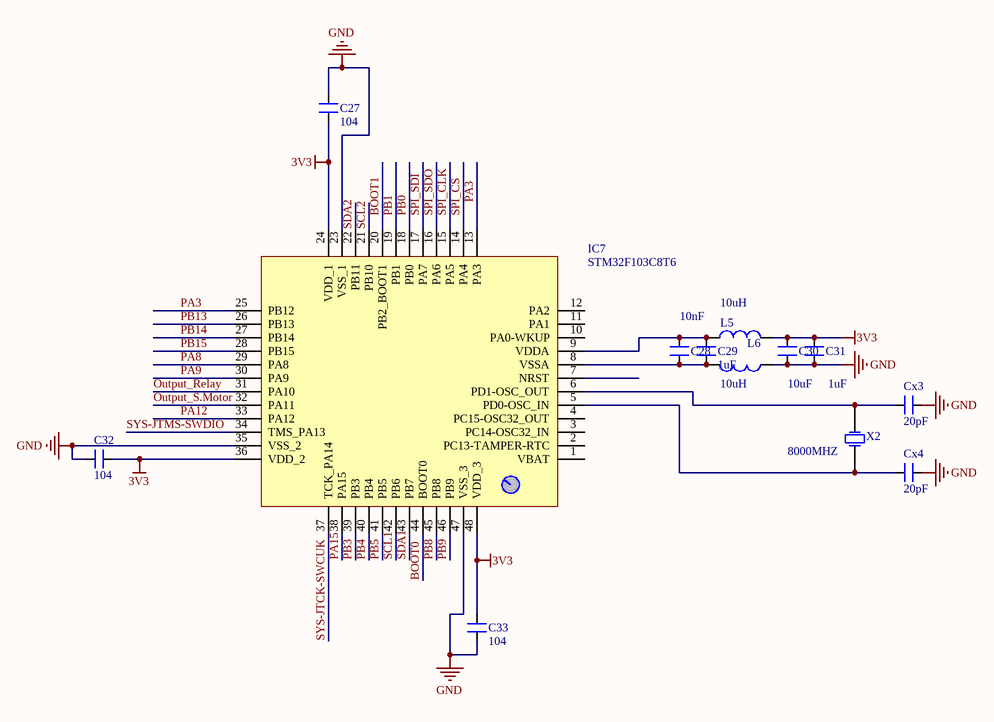
[diagram p8: MCU.SchDoc]

### Parts
C27  104  [CN2]
C28  10nF  [CN2]
C29  1uF  [CN2]
C30  10uF  [CN2]
C31  1uF  [CN2]
C32  104  [CN2]
C33  104  [CN2]
Cx3  20pF  [CN1]
Cx4  20pF  [CN1]
IC7  STM32F103C8T6  [STM32F103C8T6]
L5  10uH  [L/0.4]
L6  10uH  [L/0.4]
X2  8000MHZ  [XTAL]

### Nets
3V3: C27.1 C30.1 C31.1 C32.2 C33.2 IC7.24(VDD_1) IC7.36(VDD_2) IC7.48(VDD_3) L5.2
GND: C27.2 C30.2 C31.2 C32.1 C33.1 Cx3.1 Cx4.1 IC7.23(VSS_1) IC7.35(VSS_2) IC7.47(VSS_3) L6.1
BOOT0: IC7.44(BOOT0)
BOOT1: IC7.20(PB2_BOOT1)
Output_Relay: IC7.31(PA10)
Output_S.Motor: IC7.32(PA11)
PA3: IC7.13(PA3) IC7.25(PB12)
PA8: IC7.29(PA8)
PA9: IC7.30(PA9)
PA12: IC7.33(PA12)
PA15: IC7.38(PA15)
PB0: IC7.18(PB0)
PB1: IC7.19(PB1)
PB3: IC7.39(PB3)
PB4: IC7.40(PB4)
PB5: IC7.41(PB5)
PB8: IC7.45(PB8)
PB9: IC7.46(PB9)
PB13: IC7.26(PB13)
PB14: IC7.27(PB14)
PB15: IC7.28(PB15)
SCL1: IC7.42(PB6)
SCL2: IC7.21(PB10)
SDA1: IC7.43(PB7)
SDA2: IC7.22(PB11)
SPI_CLK: IC7.15(PA5)
SPI_CS: IC7.14(PA4)
SPI_SDI: IC7.17(PA7)
SPI_SDO: IC7.16(PA6)
SYS-JTCK-SWCUK: IC7.37(TCK_PA14)
SYS-JTMS-SWDIO: IC7.34(TMS_PA13)
NetC28_1: C28.1 C29.1 IC7.9(VDDA) L5.1
NetC28_2: C28.2 C29.2 IC7.8(VSSA) L6.2
NetCx3_2: Cx3.2 IC7.6(PD1-OSC_OUT) X2.2(OSC2)
NetCx4_2: Cx4.2 IC7.5(PD0-OSC_IN) X2.1(OSC1)

Not connected (* = marked no-connect by the designer): IC7 1(VBAT) 2(PC13-TAMPER-RTC) 3(PC14-OSC32_IN) 4(PC15-OSC32_OUT) 7(NRST) 10(PA0-WKUP) 11(PA1) 12(PA2)

### Library data of the parts
C27-C33 = CN2: Cap np 104 => 105pF; Value: 0.1uF
Cx3 Cx4 = CN0: as Cx1 on sheet nhung
L5 L6 = L1: Inductor; Value: 150 mH
X2 = XTAL: Crystal Oscillator; Published: 8-Jun-2000; LatestRevisionDate: 17-Jul-2002; LatestRevisionNote: Re-released for DXP Platform.; PackageReference: R38; Publisher: Altium Limited

## Nets that join several sheets
3.3VDC: temperature (5 pins), nhung (11 pins), controltemperature (P2.3 R26.2), humiditycontrol (P4.3 R1.2)
3V3: nhung (9 pins), MCU (9 pins)
+5: lcdi2c (R4.1 R5.1 R6.1 U2.16), nhung (11 pins), controltemperature (R27.2), humiditycontrol (R2.2 R3.2 R33.2 SERVO_MOTOR2.1), Alarm (R28.2)
+12: nhung (Rssr.2), controltemperature (R24.2)
GND: nguon (32 pins), temperature (6 pins), humidity (MCU.2), lcdi2c (8 pins), nhung (77 pins), controltemperature (P2.2 Q6.1), Alarm (HD2.2 Q9.1), MCU (11 pins)
VDD: humidity (MCU.3 R7.2 R8.2), nhung (7 pins)
NetC1_1: nguon (C1.1), nhung (C20.1)
NetC1_2: nguon (C1.2), nhung (C20.2)
NetR_ref_1: temperature (R_ref.1), nhung (R_ref1.1)
NetR_ref_2: temperature (R_ref.2), nhung (R_ref1.2)
NetRHS_2: nguon (RHS1.2 RLS1.1), nhung (RHS.2 RLS.1)